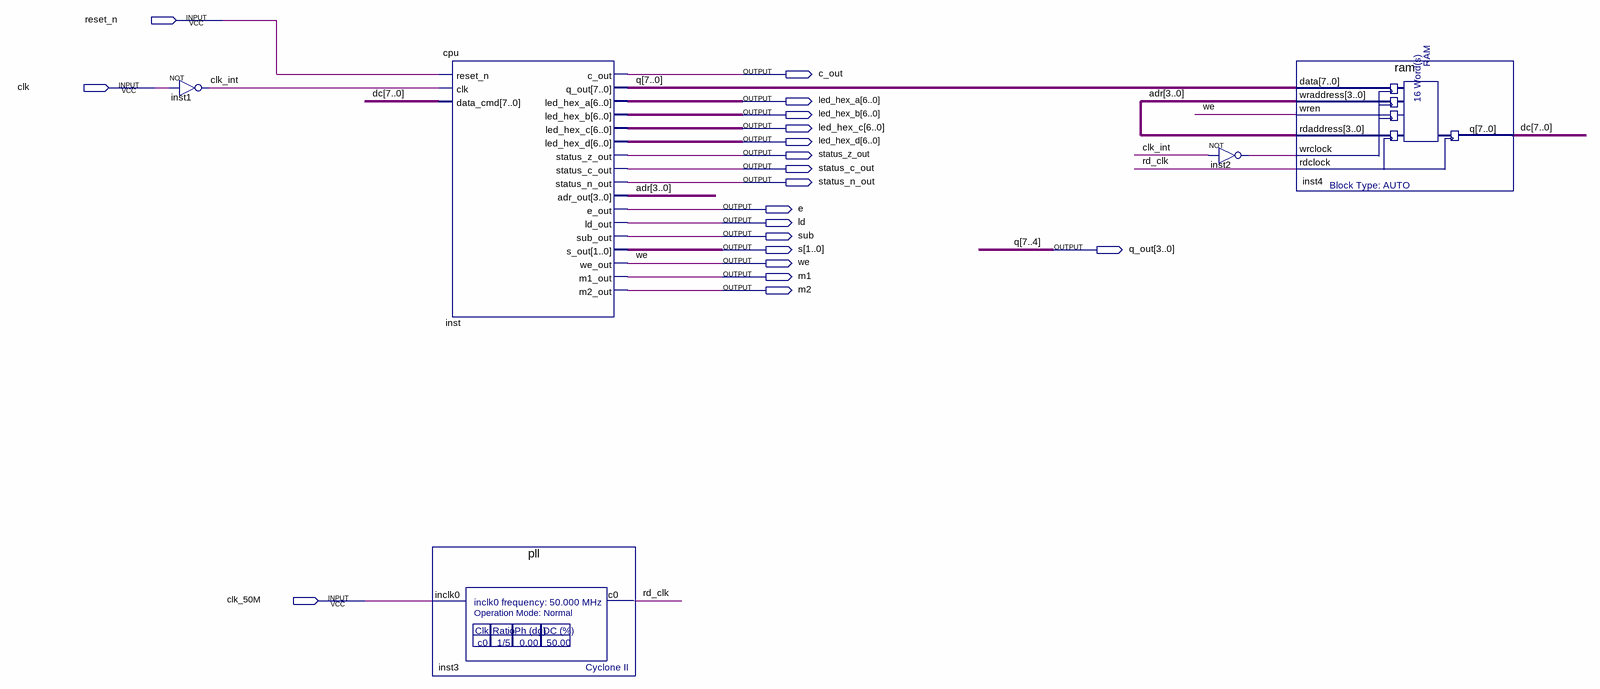
[diagram p0: schematic sheet]
// Quartus schematic uP.bdf as structural Verilog: 5 symbols, 19 pins
module uP (
  input  reset_n,
  input  clk,
  input  clk_50M,
  output c_out,
  output [6:0] led_hex_a,
  output [6:0] led_hex_b,
  output [6:0] led_hex_c,
  output [6:0] led_hex_d,
  output status_z_out,
  output status_c_out,
  output status_n_out,
  output e,
  output ld,
  output sub,
  output [1:0] s,
  output [3:0] q_out,
  output we,
  output m1,
  output m2
);

  wire clk_int, inst2_out, rd_clk;
  wire [3:0] adr, q;
  wire [7:0] dc;

  not inst1 (clk_int, clk);
  pll inst3 (.inclk0(clk_50M), .c0(rd_clk));
  cpu inst (
    .reset_n(reset_n), .clk(clk_int), .data_cmd(dc), .c_out(c_out), .q_out({q_out, q}),
    .led_hex_a(led_hex_a), .led_hex_b(led_hex_b), .led_hex_c(led_hex_c), .led_hex_d(led_hex_d),
    .status_z_out(status_z_out), .status_c_out(status_c_out), .status_n_out(status_n_out), .adr_out(adr),
    .e_out(e), .ld_out(ld), .sub_out(sub), .s_out(s), .we_out(we), .m1_out(m1), .m2_out(m2));
  not inst2 (inst2_out, clk_int);
  ram inst4 (
    .data({q_out, q}), .wraddress(adr), .wren(we), .rdaddress(adr), .wrclock(inst2_out), .rdclock(rd_clk),
    .q(dc));

  // Other names for the same wires on the sheet: q[7:4] = q_out
endmodule
